# Altium project RC_Remote.PrjPcb
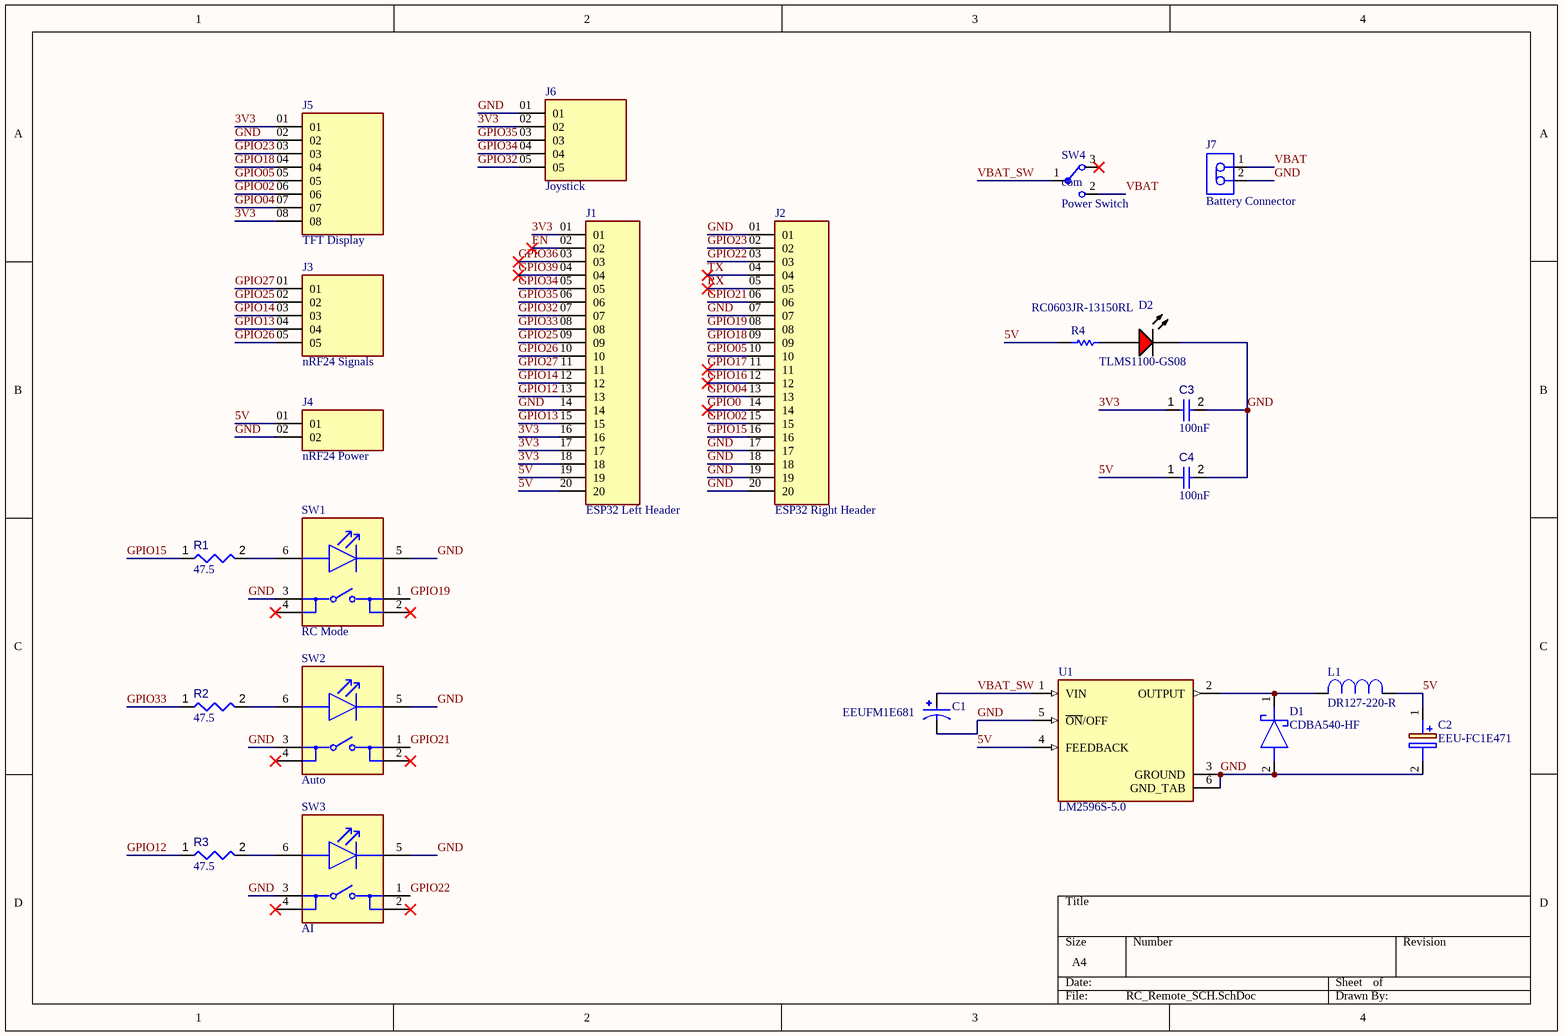
[diagram p0: RC_Remote_SCH.SchDoc]
1 sheet, 23 parts. Net scope: global (net labels, ports and power ports of the same name join across sheets).
Board file: RC_Remote.PcbDoc

## Sheet RC_Remote_SCH.SchDoc
size A4; SheetNumber: 1; SheetTotal: 1

### Parts
C1  EEUFM1E681  [CAPPRD500W60D1000H2000]
C2  EEU-FC1E471  [CAPPRD350W65D815H2200]
C3  value 100nF  [CAPC1608X90X40NL10T20]  (hidden comment: Capacitor 100 nF +/-10% 50 V 0603)
C4  value 100nF  [CAPC1608X90X40NL10T20]  (hidden comment: Capacitor 100 nF +/-10% 50 V 0603)
D1  CDBA540-HF  [DIOM5225X250N]
D2  TLMS1100-GS08  [VISH-TLMX1100_V]
J1  ESP32 Left Header  [SAMTEC_SSQ-120-XX-X-S]
J2  ESP32 Right Header  [SAMTEC_SSQ-120-XX-X-S]
J3  nRF24 Signals  [SAMTEC_SSQ-105-02-T-S]
J4  nRF24 Power  [SAMTEC_SSQ-102-02-T-S]
J5  TFT Display  [SAMTEC_SSQ-108-02-T-S]
J6  Joystick  [SAMTEC_SSQ-105-02-T-S]
J7  Battery Connector  [JST-B2B-PH-K-S_V]
L1  DR127-220-R  [INDM125125X800N]
R1  value 47.5  [RESA60-630X240]  (hidden comment: MFR-25FBF52-47R5)
R2  value 47.5  [RESA60-630X240]  (hidden comment: MFR-25FBF52-47R5)
R3  value 47.5  [RESA60-630X240]  (hidden comment: MFR-25FBF52-47R5)
R4  RC0603JR-13150RL  [RESC1608X55X25ML10T15]
SW1  RC Mode  [FP-B3W-9002-Y1N-MFG]
SW2  Auto  [FP-B3W-9002-Y1N-MFG]
SW3  AI  [FP-B3W-9002-Y1N-MFG]
SW4  Power Switch  [450301014042]
U1  LM2596S-5.0  [TO170P1524X483-6N]

### Nets
3V3: C3.1 J1.01 J1.16 J1.17 J1.18 J5.01 J5.08 J6.02
5V: C2.1(+) C4.1 J1.19 J1.20 J4.01 L1.1 R4.1 U1.4(FEEDBACK)
EN: J1.02
GND: C1.N C2.2(-) C3.2 C4.2 D1.2(A) D2.2(K) J1.14 J2.01 J2.07 J2.17 J2.18 J2.19 J2.20 J4.02 J5.02 J6.01 J7.2 SW1.3 SW1.5(C) SW2.3 SW2.5(C) SW3.3 SW3.5(C) U1.3(GROUND) U1.5(~{ON}/OFF) U1.6(GND_TAB)
GPIO0: J2.14
GPIO02: J2.15 J5.06
GPIO04: J2.13 J5.07
GPIO05: J2.10 J5.05
GPIO12: J1.13 R3.1
GPIO13: J1.15 J3.04
GPIO14: J1.12 J3.03
GPIO15: J2.16 R1.1
GPIO16: J2.12
GPIO17: J2.11
GPIO18: J2.09 J5.04
GPIO19: J2.08 SW1.1
GPIO21: J2.06 SW2.1
GPIO22: J2.03 SW3.1
GPIO23: J2.02 J5.03
GPIO25: J1.09 J3.02
GPIO26: J1.10 J3.05
GPIO27: J1.11 J3.01
GPIO32: J1.07 J6.05
GPIO33: J1.08 R2.1
GPIO34: J1.05 J6.04
GPIO35: J1.06 J6.03
GPIO36: J1.03
GPIO39: J1.04
RX: J2.05
TX: J2.04
VBAT: J7.1 SW4.2
VBAT_SW: C1.P SW4.1 U1.1(VIN)
NetD1_1: D1.1(K) L1.2 U1.2(OUTPUT)
NetD2_1: D2.1(A) R4.2
NetR1_2: R1.2 SW1.6(A)
NetR2_2: R2.2 SW2.6(A)
NetR3_2: R3.2 SW3.6(A)

Not connected (* = marked no-connect by the designer): SW1 2* 4*; SW2 2* 4*; SW3 2* 4*; SW4 3*

### Notes on the sheet
- (in symbol 450301014042) com

### Library data of the parts
C1 = EEUFM1E681: 680F 25V Aluminum Electrolytic Capacitors Radial, Can 5000 Hrs @ 105C; MF: Panasonic; Purchase-URL: https://pricing.snapeda.com/search?q=EEUFM1E681&ref=eda; Package: RADIAL-2 Panasonic; Check_prices: https://www.snapeda.com/parts/EEUFM1E681/Panasonic/view-part/?ref=eda; Value: *; SnapEDA_Link: https://www.snapeda.com/parts/EEUFM1E681/Panasonic/view-part/?ref=snap; MP: EEUFM1E681; Digi-Key_Part_Number: P12390-ND
C2 = EEU-FC1E471: Capacitor Polarised; Manufacturer_Name: Panasonic; Datasheet Link: http://industrial.panasonic.com/cdbs/www-data/pdf/RDF0000/ABA0000C1209.pdf; Height: 22mm; Manufacturer_Part_Number: EEU-FC1E471; Mouser Part Number: 667-EEU-FC1E471; Mouser Price/Stock: https://www.mouser.co.uk/ProductDetail/Panasonic/EEU-FC1E471?qs=%2FUrJKH1balAe6BYeommeDg%3D%3D; Arrow Part Number: EEU-FC1E471; Arrow Price/Stock: https://www.arrow.com/en/products/eeu-fc1e471/panasonic?region=europe
C3 C4 = CMP-001-00017-6: Chip Capacitor, 100 nF, +/- 10%, 50 V, 0603 (1608 Metric); Voltage Rating: 50V; Capacitor Type: Ceramic; Tolerance: 10%; Mounting Technology: SM; Max Operating Temperature: 125°C; RoHS Compliant: True; Pins: 2; Case/Package: 0603; Min Operating Temperature: -55°C
D1 = CDBA540-HF: Schottky Diode; Manufacturer_Name: Comchip Technology; Datasheet Link: https://datasheet.datasheetarchive.com/originals/distributors/DKDS-12/228866.pdf; Height: 2.5mm; Manufacturer_Part_Number: CDBA540-HF; Mouser Part Number: 750-CDBA540-HF; Mouser Price/Stock: https://www.mouser.co.uk/ProductDetail/Comchip-Technology/CDBA540-HF?qs=XEIV%2Fho1H6f2kHo2SATLRw%3D%3D; Arrow Part Number: CDBA540-HF; Arrow Price/Stock: https://www.arrow.com/en/products/cdba540-hf/comchip-technology?region=nac
D2 = CMP-007-00030-2: Red Led, 20mA, 2.1 V, -40 to 100 degC, 2-Pin SMD (0603), RoHS, Tape and Reel; Manufacturer: Vishay Semiconductor; Viewing Angle: 160degrees; Forward Voltage: 2.1V; Lens Style: Clear; Power: 90mW; Luminous Intensity: 63mcd; Datasheet Version: Rev. 2.7, 03/2016; Package Quantity: 3000; Colour: Red; Package Description: 2-Pin Surface Mount Device, Body 1.6 x 0.8 mm; Datasheet URL: http://www.vishay.com/docs/83173/tlmb1100.pdf; Package Reference: TLMX1100; Max Operating Temperature: 100°C; Mounting Technology: SM; Packaging: TapeandReel; Case/Package: 0603; Illumination Colour: Red; Forward Current: 20mA; Manufacturer URL: http://www.vishay.com/; RoHS Compliant: True; Min Operating Temperature: -40°C; Nominal Vf: 2.1V; Pins: 2
J1 J2 = SSQ-120-XX-X-S: 20 Position Receptacle Connector 0.100 (2.54mm) Through Hole Gold; MF: Samtec; MP: SSQ-120-22-F-S; SnapEDA_Link: https://www.snapeda.com/parts/SSQ-120-22-F-S/Samtec/view-part/?ref=snap; Package: None; Value: *; Check_prices: https://www.snapeda.com/parts/SSQ-120-22-F-S/Samtec/view-part/?ref=eda
J3 J6 = SSQ-105-02-T-S: Headers & Wire Housings .100 Tiger Buy Socket Strip, Square Tail; MF: Samtec; SnapEDA_Link: https://www.snapeda.com/parts/SSQ-105-02-T-S/Samtec/view-part/?ref=snap; Package: None; Value: *; MP: SSQ-105-02-T-S; Check_prices: https://www.snapeda.com/parts/SSQ-105-02-T-S/Samtec/view-part/?ref=eda
J4 = SSQ-102-02-T-S: SSQ Series .100 Tiger Buyâ„¢ Socket Strip, Square Tail; MF: Samtec Inc.; Check_prices: https://www.snapeda.com/parts/SSQ-102-02-T-S/Samtec+Inc./view-part/?ref=eda; Value: *; SnapEDA_Link: https://www.snapeda.com/parts/SSQ-102-02-T-S/Samtec+Inc./view-part/?ref=snap; Availability: In Stock; Package: None; Purchase-URL: https://pricing.snapeda.com/search/part/SSQ-102-02-T-S/?ref=eda; Price: None; MP: SSQ-102-02-T-S
J5 = SSQ-108-02-T-S: Headers & Wire Housings .100 Tiger Buy Socket Strip, Square Tail; MF: Samtec; SnapEDA_Link: https://www.snapeda.com/parts/SSQ-108-02-T-S/Samtec/view-part/?ref=snap; Package: None; Value: *; MP: SSQ-108-02-T-S; Check_prices: https://www.snapeda.com/parts/SSQ-108-02-T-S/Samtec/view-part/?ref=eda
J7 = CMP-2000-05162-1: Male Header, Pitch 2 mm, 1 x 2 Position, Height 6 mm, Tail Length 3.4 mm, -25 to 85 degC, RoHS, Bulk; Manufacturer: JST; Pitch: 2mm; Style/Orientation: StraightHeader/Plug; No of Positions: 2; Datasheet Version: Nov-08; Datasheet URL: http://datasheet.octopart.com/B2B-PH-K-S%28LF%29%28SN%29-JST-datasheet-8324864.pdf; Manufacturer URL: http://www.jst.com/home2.html; Type: ShroudedHeader; Termination: Crimp
L1 = DR127-220-R: 22ÂµH Shielded Wirewound Inductor 4A 39.1mOhm Nonstandard; MF: Eaton; Digi-Key_Part_Number: 513-1044-1-ND; SnapEDA_Link: https://www.snapeda.com/parts/DR127-220-R/Eaton/view-part/2774174/?ref=snap; Package: Nonstandard Eaton; MP: DR127-220-R; Digi-Key_Purchase_URL: https://www.digikey.com/product-detail/en/eaton-electronics-division/DR127-220-R/513-1044-1-ND/695325?utm_source=snapeda&utm_medium=aggregator&utm_campaign=symbol; Value: *
R1-R3 = CMP-009-00058-4: Axial Resistor, 47.5 Ohm, +/- 1%, 0.25 W, -55 to 155 degC, 2-Pin THD, RoHS, Bulk; Manufacturer: Yageo; Voltage Rating: 250V; Power: 250mW; Packaging: Bulk; Package Description: 2-Pin Axial Lead, Dia 2.4 mm, Body Length 6.3 mm; Package Reference: MFR-25; Case/Package: Axial; Tolerance: 1%; RoHS Compliant: True; Package Quantity: 200; Max Operating Temperature: 155°C; Manufacturer URL: http://www.yageo.com/; Datasheet URL: http://www.yageo.com/documents/recent/Yageo%20LR_MFR_2013.pdf; Min Operating Temperature: -55°C; Datasheet Version: Apr-13; Mounting Technology: TH
R4 = CMP-2000-04317-1: Manufacturer: Yageo; Part Number: RC0603JR-13150RL
SW1-SW3 = CMP-08834-000016-1: SWITCH TACTILE SPST-NO 0.05A 24V; Operating Force: 2.26N; Mechanical Life: 300000Cycles; Actuator Color: White; Contact Resistance: 100mR; Switch Function: Off-Mom; Illumination Color: Yellow; Throw Configuration: SPST; Current Rating: 50mA; Switch Travel: 0.25mm; Illumination Type: Illuminated; Min Operating Temperature: -25°C; Max Operating Temperature: 70°C; Series: B3W-9; Packaging: Bulk; Termination: PC Pin; Package Quantity: 300; Mount: Through Hole; Orientation: Straight; Max Voltage Rating (DC): 24V; Voltage Rating (DC): 24V; Contact Plating: Silver
SW4 = 450301014042: MF: {'manufacturer': u'W\xfcrth Elektronik'}; Package: None; Price: None; Value: *; MP: 450301014042; Availability: Unavailable
U1 = LM2596S-5.0: SIMPLE SWITCHERÂ® 4.5V to 40V, 3A Low Component Count Step-Down Regulator; MF: Texas Instruments; MP: LM2596S-5.0/NOPB; SnapEDA_Link: https://www.snapeda.com/parts/LM2596S-5.0/NOPB/Texas+Instruments/view-part/?ref=snap; Package: TO-263-5 Texas Instruments; Value: *; Check_prices: https://www.snapeda.com/parts/LM2596S-5.0/NOPB/Texas+Instruments/view-part/?ref=eda